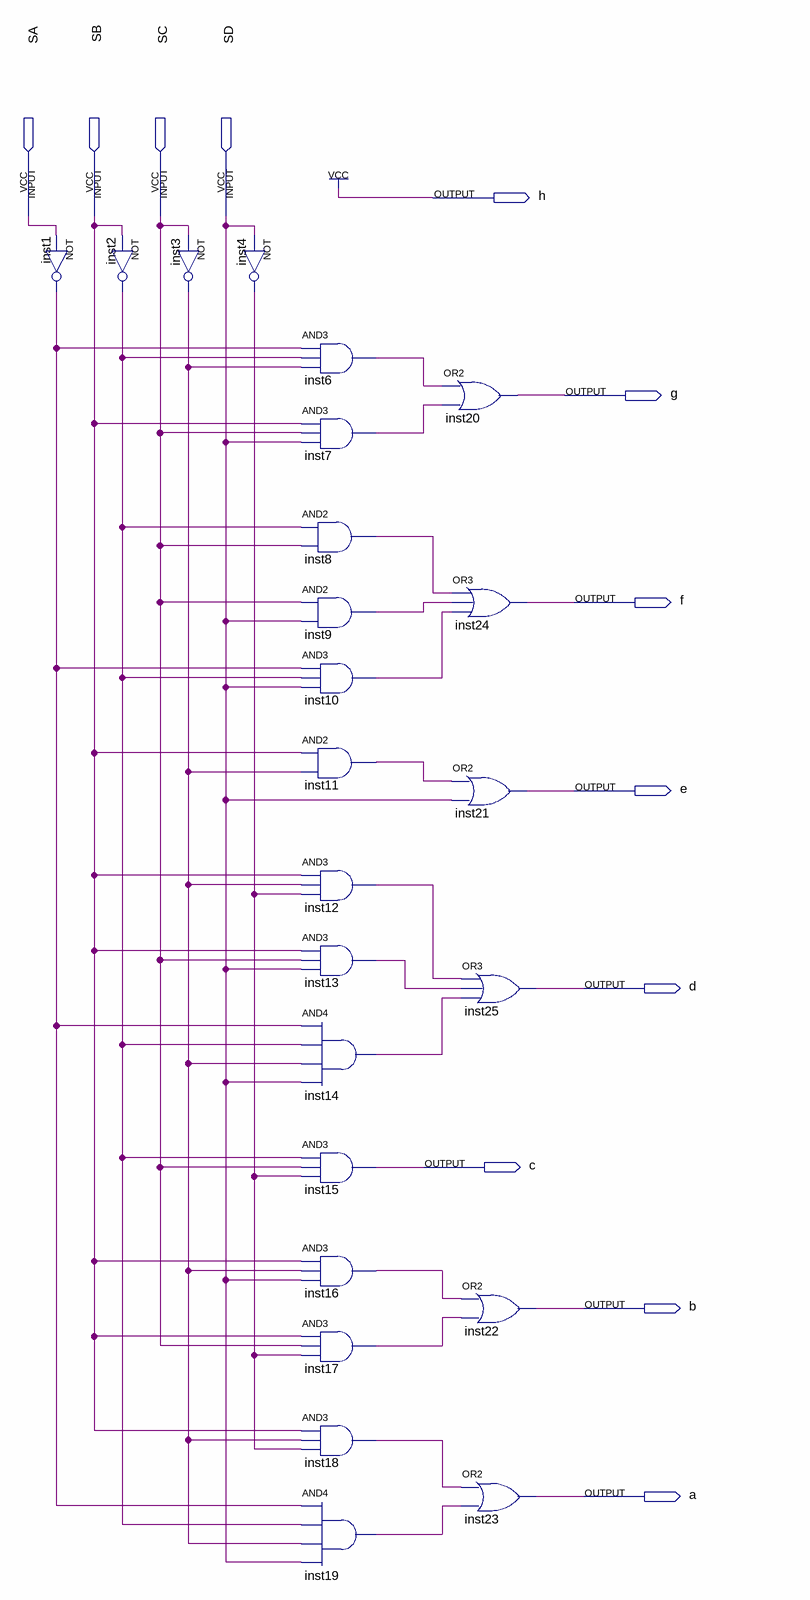
[diagram p0: schematic sheet]
// Quartus schematic 7SEG.bdf as structural Verilog: 24 symbols, 12 pins
module \7SEG  (
  input  SA,
  input  SB,
  input  SC,
  input  SD,
  output h,
  output g,
  output f,
  output e,
  output d,
  output c,
  output b,
  output a
);

  wire inst1_out, inst2_out, inst3_out, inst4_out, inst6_out, inst7_out, inst8_out, inst9_out, inst10_out,
       inst11_out, inst12_out, inst13_out, inst14_out, inst16_out, inst17_out, inst18_out, inst19_out;

  not inst1 (inst1_out, SA);
  not inst2 (inst2_out, SB);
  not inst3 (inst3_out, SC);
  not inst4 (inst4_out, SD);
  and inst6 (inst6_out, inst1_out, inst2_out, inst3_out);
  and inst7 (inst7_out, SB, SC, SD);
  and inst8 (inst8_out, inst2_out, SC);
  and inst9 (inst9_out, SC, SD);
  and inst10 (inst10_out, inst1_out, inst2_out, SD);
  and inst11 (inst11_out, SB, inst3_out);
  and inst12 (inst12_out, SB, inst3_out, inst4_out);
  and inst13 (inst13_out, SB, SC, SD);
  and inst14 (inst14_out, inst1_out, inst2_out, inst3_out, SD);
  and inst15 (c, inst2_out, SC, inst4_out);
  and inst16 (inst16_out, SB, inst3_out, SD);
  and inst17 (inst17_out, SB, SC, inst4_out);
  and inst18 (inst18_out, SB, inst3_out, inst4_out);
  and inst19 (inst19_out, inst1_out, inst2_out, inst3_out, SD);
  or inst20 (g, inst6_out, inst7_out);
  or inst24 (f, inst8_out, inst9_out, inst10_out);
  or inst21 (e, inst11_out, SD);
  or inst25 (d, inst12_out, inst13_out, inst14_out);
  or inst22 (b, inst16_out, inst17_out);
  or inst23 (a, inst18_out, inst19_out);

  assign h = 1'b1;
endmodule
